# Altium project Suprise.PrjPCB
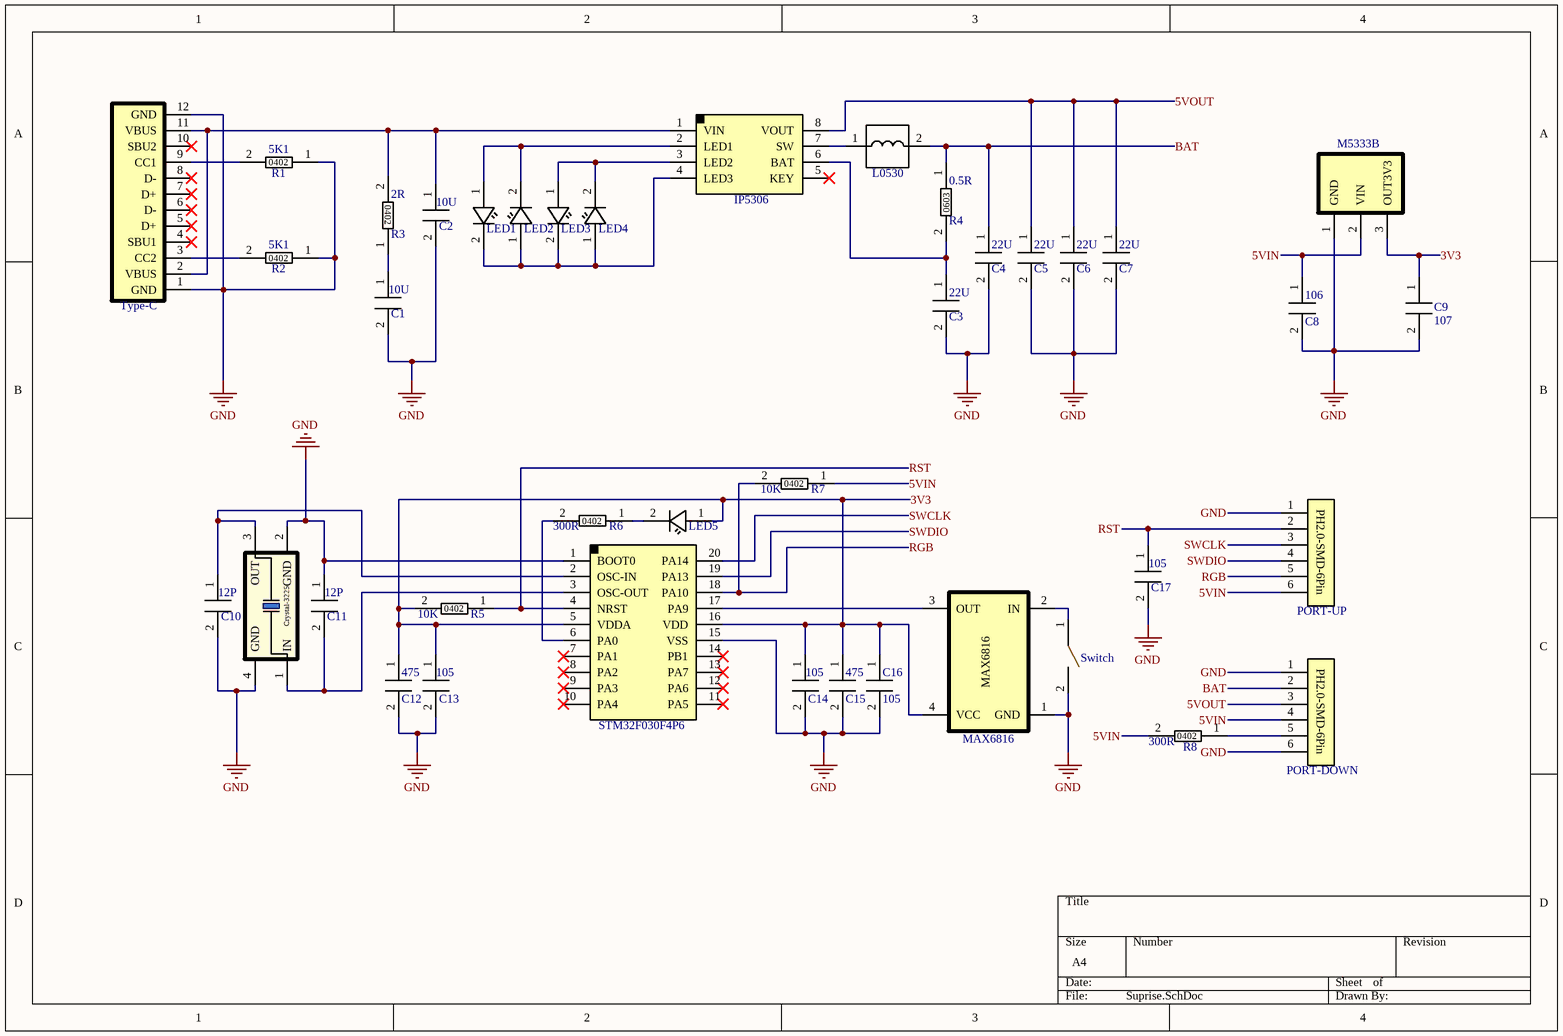
[diagram p0: Suprise.SchDoc]
1 sheet, 40 parts. Net scope: global (net labels, ports and power ports of the same name join across sheets).
Board file: Suprise.PcbDoc

## Sheet Suprise.SchDoc
size A4

### Parts
3225-8MHz  Crystal-3225  [Crystal-3225]  (value not drawn)
C1  10U  [CAP0402]
C2  10U  [CAP0402]
C3  22U  [CAP0402]
C4  22U  [CAP0402]
C5  22U  [CAP0402]
C6  22U  [CAP0402]
C7  22U  [CAP0402]
C8  106  [CAP0402]
C9  107  [CAP0402]
C10  12P  [CAP0402]
C11  12P  [CAP0402]
C12  475  [CAP0402]
C13  105  [CAP0402]
C14  105  [CAP0402]
C15  475  [CAP0402]
C16  105  [CAP0402]
C17  105  [CAP0402]
IP5306  IP5306  [IP5306]  (value not drawn)
L0530  IND0530  [IND0530]  (value not drawn)
LED1  LED0603  [LED0603]  (value not drawn)
LED2  LED0603  [LED0603]  (value not drawn)
LED3  LED0603  [LED0603]  (value not drawn)
LED4  LED0603  [LED0603]  (value not drawn)
LED5  LED0603  [LED0603]  (value not drawn)
M5333B  M5333B  [M5333B]  (value not drawn)
MAX6816  MAX6816  [MAX6816]  (value not drawn)
PORT-DOWN  PH2.0-SMD-6Pin  [PH2.0-SMD-6Pin]  (value not drawn)
PORT-UP  PH2.0-SMD-6Pin  [PH2.0-SMD-6Pin]  (value not drawn)
R1  5K1  [RES0402]
R2  5K1  [RES0402]
R3  2R  [RES0402]
R4  0.5R  [RES0603]
R5  10K  [RES0402]
R6  300R  [RES0402]
R7  10K  [RES0402]
R8  300R  [RES0402]
STM32F030F4P6  STM32F030F4P6  [STM32F030F4P6]  (value not drawn)
Switch  Key-4*4*1.5  [Key-4*4*1.5]  (value not drawn)
Type-C  Type-C-IN-16Pin  [SinkBoard-Type-C-IN-16Pin]  (value not drawn)

### Nets
GND: 3225-8MHz.2(GND) 3225-8MHz.4(GND) C1.2 C2.2 C3.2 C4.2 C5.2 C6.2 C7.2 C8.2 C9.2 C10.2 C11.1 C12.2 C13.2 C14.2 C15.2 C16.2 C17.2 M5333B.1(GND) MAX6816.1(GND) PORT-DOWN.1 PORT-DOWN.6 PORT-UP.1 R1.1 R2.1 STM32F030F4P6.1(BOOT0) STM32F030F4P6.15(VSS) Switch.2 Type-C.1(GND) Type-C.12(GND)
3V3: C9.1 C12.1 C13.1 C14.1 C15.1 C16.1 LED5.1 M5333B.3(OUT3V3) MAX6816.4(VCC) R5.2 STM32F030F4P6.5(VDDA) STM32F030F4P6.16(VDD)
5VIN: C8.1 M5333B.2(VIN) PORT-DOWN.4 PORT-UP.6 R7.1 R8.2
5VOUT: C5.1 C6.1 C7.1 IP5306.8(VOUT) PORT-DOWN.3
BAT: C4.1 L0530.2 PORT-DOWN.2 R4.1
RGB: PORT-UP.5 R7.2 STM32F030F4P6.18(PA10)
RST: C17.1 PORT-UP.2 R5.1 STM32F030F4P6.4(NRST)
SWCLK: PORT-UP.3 STM32F030F4P6.20(PA14)
SWDIO: PORT-UP.4 STM32F030F4P6.19(PA13)
Net3225-8MHz_1: 3225-8MHz.1(IN) C11.2 STM32F030F4P6.3(OSC-OUT)
Net3225-8MHz_3: 3225-8MHz.3(OUT) C10.1 STM32F030F4P6.2(OSC-IN)
NetC1_1: C1.1 R3.1
NetC2_1: C2.1 IP5306.1(VIN) R3.2 Type-C.2(VBUS) Type-C.11(VBUS)
NetC3_1: C3.1 IP5306.6(BAT) R4.2
NetIP5306_2: IP5306.2(LED1) LED1.1 LED2.2
NetIP5306_3: IP5306.3(LED2) LED3.1 LED4.2
NetIP5306_4: IP5306.4(LED3) LED1.2 LED2.1 LED3.2 LED4.1
NetIP5306_7: IP5306.7(SW) L0530.1
NetLED5_2: LED5.2 R6.1
NetMAX6816_2: MAX6816.2(IN) Switch.1
NetMAX6816_3: MAX6816.3(OUT) STM32F030F4P6.17(PA9)
NetPORT-DOWN_5: PORT-DOWN.5 R8.1
NetR1_2: R1.2 Type-C.9(CC1)
NetR2_2: R2.2 Type-C.3(CC2)
NetR6_2: R6.2 STM32F030F4P6.6(PA0)

Not connected (* = marked no-connect by the designer): IP5306 5(KEY)*; STM32F030F4P6 7(PA1)* 8(PA2)* 9(PA3)* 10(PA4)* 11(PA5)* 12(PA6)* 13(PA7)* 14(PB1)*; Type-C 4(SBU1)* 5(D+)* 6(D-)* 7(D+)* 8(D-)* 10(SBU2)*

### Notes on the sheet
- (in symbol RES0402) 0402
- (in symbol RES0603) 0603

### Library data of the parts
C1-C17 = CAP0402
R1-R3 R5-R8 = RES0402
R4 = RES0603